# Altium project 1200_1100_LCD_Header.PrjPcb
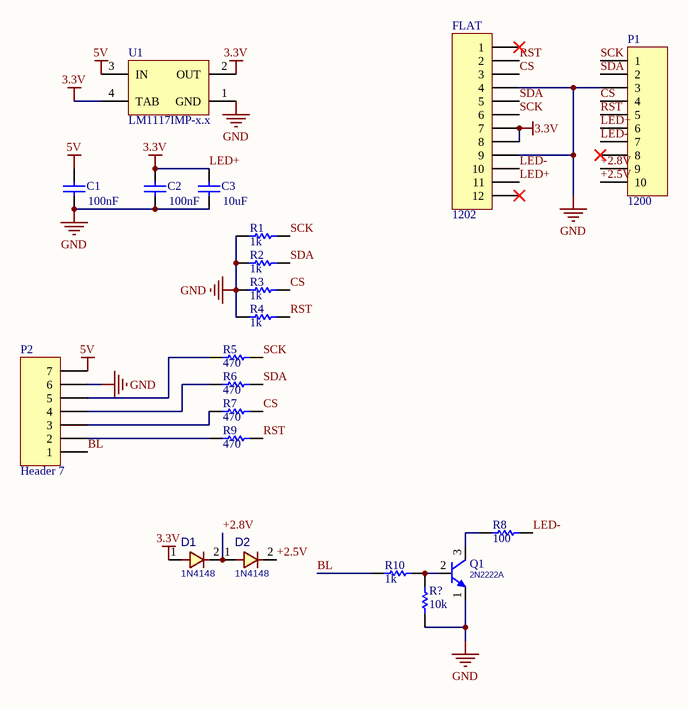
[diagram p0: Sheet2.SchDoc]
1 sheet, 21 parts. Net scope: global (net labels, ports and power ports of the same name join across sheets).
Board file: PCB3.PcbDoc

## Sheet Sheet2.SchDoc
size B

### Parts
C1  value 100nF  [IND0805]  (hidden comment: Cap)
C2  value 100nF  [IND0805]  (hidden comment: Cap)
C3  value 10uF  [C1206]  (hidden comment: Cap)
D1  1N4148  [D_SOD80]
D2  1N4148  [D_SOD80]
FLAT  1202  [1202_LCD]
P1  1200  [1200_1100_LCD]
P2  Header 7  [HDR1X7]
Q1  2N2222A  [SOT23_N]
R1  1k  [J1-0603]
R2  1k  [J1-0603]
R3  1k  [J1-0603]
R4  1k  [J1-0603]
R5  470  [J1-0603]
R6  470  [J1-0603]
R7  470  [J1-0603]
R8  100  [J1-0603]
R9  470  [J1-0603]
R10  1k  [J1-0603]
R?  10k  [J1-0603]
U1  LM1117IMP-x.x  [MP04A_N]

### Nets
5V: C1.2 P2.7 U1.3(IN)
GND: C1.1 C2.1 C3.1 FLAT.4 FLAT.9 P1.3 P2.6 Q1.1(E) R1.1 R2.1 R3.1 R4.1 R?.1 U1.1(GND)
LED+: C2.2 C3.2 D1.1 FLAT.7 FLAT.8 FLAT.11 P1.6 U1.2(OUT) U1.4(TAB)  [also labelled 3.3V]
+2.5V: D2.2 P1.10
+2.8V: D1.2 D2.1 P1.9
BL: P2.1 R10.1
CS: FLAT.3 P1.4 R3.2 R7.2
LED-: FLAT.10 P1.7 R8.2
RST: FLAT.2 P1.5 R4.2 R9.2
SCK: FLAT.6 P1.1 R1.2 R5.2
SDA: FLAT.5 P1.2 R2.2 R6.2
NetP2_2: P2.2 R9.1
NetP2_3: P2.3 R7.1
NetP2_4: P2.4 R6.1
NetP2_5: P2.5 R5.1
NetQ1_2: Q1.2(B) R10.2 R?.2
NetQ1_3: Q1.3(C) R8.1

Not connected (* = marked no-connect by the designer): FLAT 1* 12*; P1 8*

### Library data of the parts
C1-C3 = Cap: Capacitor; Published: 8-Jun-2000; LatestRevisionDate: 17-Jul-2002; LatestRevisionNote: Re-released for DXP Platform.; PackageReference: RAD-0.3; Publisher: Altium Limited; PackageDescription: Radial Cap, Thru-Hole; 2 Leads; 0.3 in Pin Spacing
D1 D2 = DIODE_SMD_1N4148: DIODE, FAST SWTICHING, 0.3A, 0.5W; DESC: DESCRIPTION; PARAM: 75V; PARAM2: 300mA, 0.5W; MANF: MANF; ASSEMBLY: ASSEMBLY; PRICE: PRICE; MANF_P#: 1N4148; VALUE: 1N4148
FLAT = Header 12: Header, 12-Pin; LatestRevisionDate: 17-Jul-2002; LatestRevisionNote: Re-released for DXP Platform.; Publisher: Altium Limited
P1 = Header 10: Header, 10-Pin; LatestRevisionDate: 17-Jul-2002; LatestRevisionNote: Re-released for DXP Platform.; Publisher: Altium Limited
P2 = Header 7: Header, 7-Pin; LatestRevisionDate: 17-Jul-2002; LatestRevisionNote: Re-released for DXP Platform.; Publisher: Altium Limited
Q1 = NPN_2N2222A_TO92: BJT, NPN, 40v, 0.6A, THD, TO92; pin to pad: 1>2 2>3 3>1; PARAM: 0.6A, hFE100~300; PARAM2: 40v, 625mW; MANF: DIOTEC; MANF_P#: 2N2222A; VALUE: 2N2222A
R1-R10 R? = Res1: Resistor; Published: 8-Jun-2000; LatestRevisionDate: 17-Jul-2002; LatestRevisionNote: Re-released for DXP Platform.; PackageReference: AXIAL-0.3; Publisher: Altium Limited; PackageDescription: Axial Device, Thru-Hole; 2 Leads; 0.3 in Pin Spacing
U1 = LM1117IMP-x.x: x.x Volt, 800mA Low-Dropout Linear Regulator, 4-pin SOT-223; PartNumber: LM1117IMP-3.3; Manufacturer: National Semiconductor; PackageTopMarking: XYTT*N05B; PowerWise: N; CompType: LDO IC; Published: 4-Dec-2008; DatasheetVersion: Apr-2006; PackageVersion: revB, Apr-2003; PackageReference: MP04A; Publisher: Altium Limited; PackageDescription: Molded SOT-223, 6.50 x 3.56 x 1.6mm Body, 4 Lead, 2.3mm Pitch; Supplier 1: Farnell; Supplier Part Number 1: 7614123; RoHS: N; PinCount: 4; Code_JEDEC: TO-261-AA; Code_IPC: SOT223-4; ComponentLink1Description: LM1117 Datasheet; ComponentLink1URL: http://www.national.com/ds/LM/LM1117.pdf; ComponentLink2Description: LM1117 Web Page; ComponentLink2URL: http://www.national.com/pf/LM/LM1117.html; ComponentLink3Description: MP04A Package Page; ComponentLink3URL: http://www.national.com/packaging/folders/mp04a.html